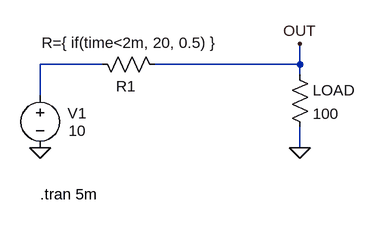
[diagram p0: schematic Resistor_TimeDependent.asc]
Resistor_TimeDependent.asc, the LTspice schematic file:
Version 4.1
SHEET 1 880 680
WIRE 80 32 -16 32
WIRE 384 32 384 0
WIRE 384 32 160 32
WIRE 384 48 384 32
WIRE -16 80 -16 32
WIRE 384 160 384 128
FLAG 384 160 0
FLAG -16 160 0
FLAG 384 0 OUT
SYMBOL res 176 48 M270
WINDOW 0 -33 60 VTop 2
WINDOW 3 65 54 VBottom 2
SYMATTR InstName R1
SYMATTR Value R={ if(time<2m, 20, 0.5) }
SYMBOL voltage -16 64 R0
WINDOW 123 0 0 Left 2
WINDOW 39 0 0 Left 2
WINDOW 0 42 43 Left 2
WINDOW 3 44 70 Left 2
SYMATTR InstName V1
SYMATTR Value 10
SYMBOL res 368 32 R0
SYMATTR InstName LOAD
SYMATTR Value 100
TEXT -16 232 Left 2 !.tran 5m

The netlist it stands for:
* Resistor_TimeDependent.asc
R1 OUT N001 R={ if(time<2m, 20, 0.5) }
V1 N001 0 10
R§LOAD OUT 0 100
.tran 5m
.backanno
.end

* Results of the author's LTspice run, read from the files saved beside the schematic
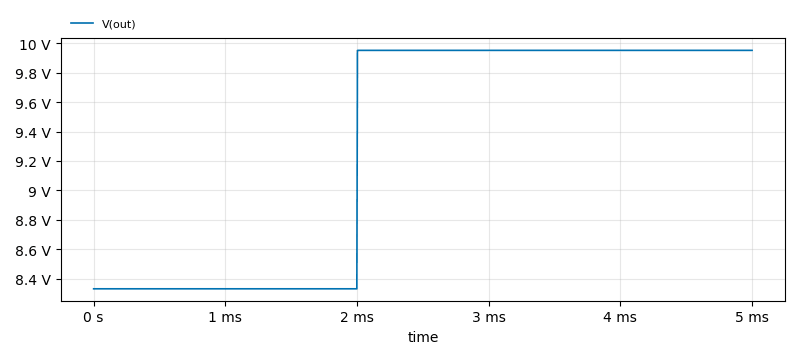
[diagram p1: Transient Analysis of Resistor_TimeDependent.asc, plotted from the saved traces]
* Transient Analysis, 1 run:
*   V(out): min 8.333 V, max 9.95 V, average 9.303 V, rms 9.337 V, last 9.95 V